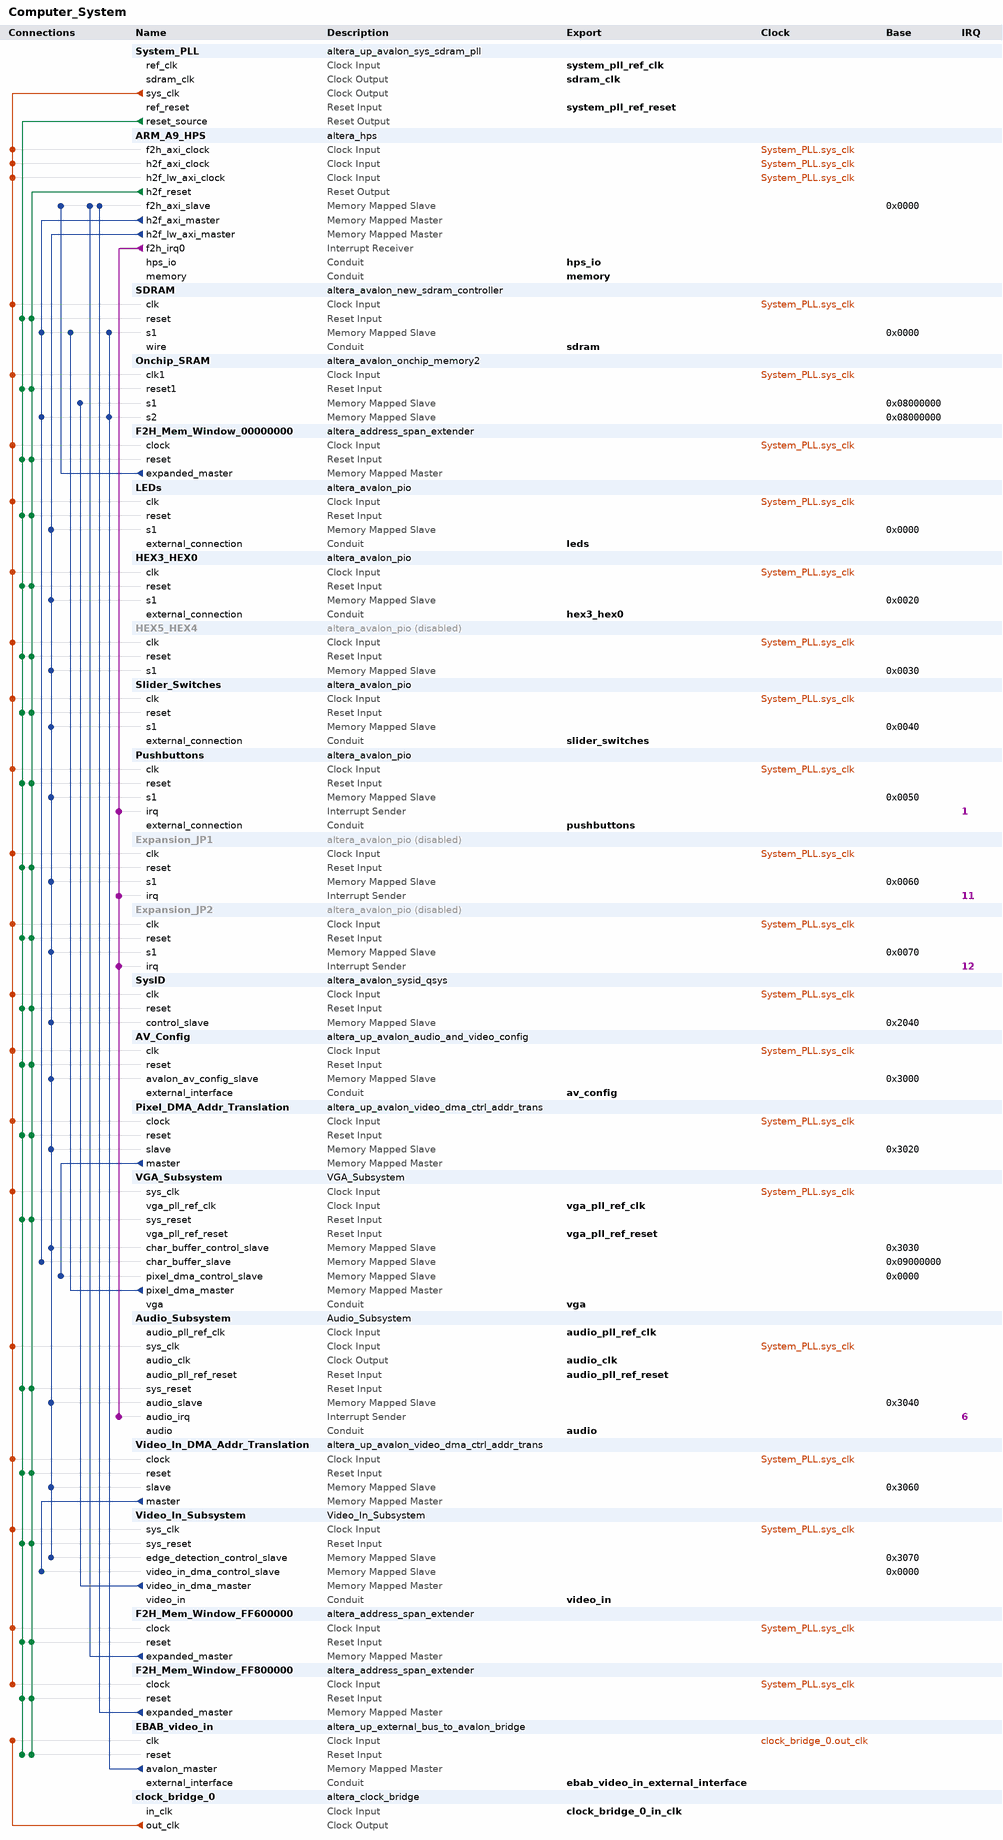
[diagram p0: system contents]
# Platform Designer (Qsys) system Computer_System, Cyclone V 5CSEMA5F31C6
# Parameters at their usual value, and those the tool derives, are not listed.
package require -exact qsys 15.0
create_system Computer_System
set_project_property DEVICE_FAMILY {Cyclone V}
set_project_property DEVICE 5CSEMA5F31C6

add_instance System_PLL altera_up_avalon_sys_sdram_pll 15.0
set_instance_parameter_value System_PLL CV_boards DE1-SoC
set_instance_parameter_value System_PLL gui_outclk 100.0
set_instance_parameter_value System_PLL gui_refclk 50.0

add_instance ARM_A9_HPS altera_hps 15.0
set_instance_parameter_value ARM_A9_HPS EMAC1_Mode RGMII
set_instance_parameter_value ARM_A9_HPS EMAC1_PinMuxing {HPS I/O Set 0}
set_instance_parameter_value ARM_A9_HPS F2SCLK_COLDRST_Enable false
set_instance_parameter_value ARM_A9_HPS F2SCLK_DBGRST_Enable false
set_instance_parameter_value ARM_A9_HPS F2SCLK_WARMRST_Enable false
set_instance_parameter_value ARM_A9_HPS F2SINTERRUPT_Enable true
set_instance_parameter_value ARM_A9_HPS F2S_Width 2
set_instance_parameter_value ARM_A9_HPS FPGA_PERIPHERAL_OUTPUT_CLOCK_FREQ_EMAC0_GTX_CLK 125
set_instance_parameter_value ARM_A9_HPS FPGA_PERIPHERAL_OUTPUT_CLOCK_FREQ_EMAC0_MD_CLK 100.0
set_instance_parameter_value ARM_A9_HPS FPGA_PERIPHERAL_OUTPUT_CLOCK_FREQ_EMAC1_GTX_CLK 125
set_instance_parameter_value ARM_A9_HPS FPGA_PERIPHERAL_OUTPUT_CLOCK_FREQ_EMAC1_MD_CLK 100.0
set_instance_parameter_value ARM_A9_HPS HPS_PROTOCOL DDR3
set_instance_parameter_value ARM_A9_HPS I2C0_Mode I2C
set_instance_parameter_value ARM_A9_HPS I2C0_PinMuxing {HPS I/O Set 0}
set_instance_parameter_value ARM_A9_HPS I2C1_Mode I2C
set_instance_parameter_value ARM_A9_HPS I2C1_PinMuxing {HPS I/O Set 0}
set_instance_parameter_value ARM_A9_HPS LWH2F_Enable true
set_instance_parameter_value ARM_A9_HPS MEM_BANKADDR_WIDTH 3
set_instance_parameter_value ARM_A9_HPS MEM_CLK_FREQ 400.0
set_instance_parameter_value ARM_A9_HPS MEM_COL_ADDR_WIDTH 10
set_instance_parameter_value ARM_A9_HPS MEM_DQ_WIDTH 32
set_instance_parameter_value ARM_A9_HPS MEM_DRV_STR RZQ/7
set_instance_parameter_value ARM_A9_HPS MEM_ROW_ADDR_WIDTH 15
set_instance_parameter_value ARM_A9_HPS MEM_RTT_NOM RZQ/4
set_instance_parameter_value ARM_A9_HPS MEM_RTT_WR RZQ/4
set_instance_parameter_value ARM_A9_HPS MEM_TCL 11
set_instance_parameter_value ARM_A9_HPS MEM_TFAW_NS 30.0
set_instance_parameter_value ARM_A9_HPS MEM_TRAS_NS 35.0
set_instance_parameter_value ARM_A9_HPS MEM_TRCD_NS 13.75
set_instance_parameter_value ARM_A9_HPS MEM_TRFC_NS 260.0
set_instance_parameter_value ARM_A9_HPS MEM_TRP_NS 13.75
set_instance_parameter_value ARM_A9_HPS MEM_VENDOR JEDEC
set_instance_parameter_value ARM_A9_HPS MEM_WTCL 8
set_instance_parameter_value ARM_A9_HPS QSPI_Mode {1 SS}
set_instance_parameter_value ARM_A9_HPS QSPI_PinMuxing {HPS I/O Set 0}
set_instance_parameter_value ARM_A9_HPS REF_CLK_FREQ 25.0
set_instance_parameter_value ARM_A9_HPS S2F_Width 3
set_instance_parameter_value ARM_A9_HPS SDIO_Mode {4-bit Data}
set_instance_parameter_value ARM_A9_HPS SDIO_PinMuxing {HPS I/O Set 0}
set_instance_parameter_value ARM_A9_HPS SPIM1_Mode {Single Slave Select}
set_instance_parameter_value ARM_A9_HPS SPIM1_PinMuxing {HPS I/O Set 0}
set_instance_parameter_value ARM_A9_HPS STM_Enable false
set_instance_parameter_value ARM_A9_HPS TIMING_BOARD_AC_SKEW 0.03
set_instance_parameter_value ARM_A9_HPS TIMING_BOARD_AC_TO_CK_SKEW 0.0
set_instance_parameter_value ARM_A9_HPS TIMING_BOARD_DQ_TO_DQS_SKEW 0.0
set_instance_parameter_value ARM_A9_HPS TIMING_BOARD_MAX_CK_DELAY 0.03
set_instance_parameter_value ARM_A9_HPS TIMING_BOARD_MAX_DQS_DELAY 0.02
set_instance_parameter_value ARM_A9_HPS TIMING_BOARD_SKEW_BETWEEN_DQS 0.08
set_instance_parameter_value ARM_A9_HPS TIMING_BOARD_SKEW_CKDQS_DIMM_MAX 0.16
set_instance_parameter_value ARM_A9_HPS TIMING_BOARD_SKEW_CKDQS_DIMM_MIN 0.09
set_instance_parameter_value ARM_A9_HPS TIMING_BOARD_SKEW_WITHIN_DQS 0.01
set_instance_parameter_value ARM_A9_HPS TIMING_TDH 65
set_instance_parameter_value ARM_A9_HPS TIMING_TDQSCK 255
set_instance_parameter_value ARM_A9_HPS TIMING_TDQSQ 125
set_instance_parameter_value ARM_A9_HPS TIMING_TDS 30
set_instance_parameter_value ARM_A9_HPS TIMING_TIH 140
set_instance_parameter_value ARM_A9_HPS TIMING_TIS 180
set_instance_parameter_value ARM_A9_HPS TIMING_TQSH 0.4
set_instance_parameter_value ARM_A9_HPS UART0_Mode {No Flow Control}
set_instance_parameter_value ARM_A9_HPS UART0_PinMuxing {HPS I/O Set 0}
set_instance_parameter_value ARM_A9_HPS USB1_Mode SDR
set_instance_parameter_value ARM_A9_HPS USB1_PinMuxing {HPS I/O Set 0}
set_instance_parameter_value ARM_A9_HPS desired_cfg_clk_mhz 100.0
set_instance_parameter_value ARM_A9_HPS desired_qspi_clk_mhz 400.0

add_instance SDRAM altera_avalon_new_sdram_controller 15.0
set_instance_parameter_value SDRAM TAC 5.5
set_instance_parameter_value SDRAM TRCD 20.0
set_instance_parameter_value SDRAM TRP 20.0
set_instance_parameter_value SDRAM casLatency 3
set_instance_parameter_value SDRAM columnWidth 10
set_instance_parameter_value SDRAM dataWidth 16
set_instance_parameter_value SDRAM generateSimulationModel true
set_instance_parameter_value SDRAM model single_Micron_MT48LC4M32B2_7_chip
set_instance_parameter_value SDRAM numberOfBanks 4
set_instance_parameter_value SDRAM numberOfChipSelects 1
set_instance_parameter_value SDRAM powerUpDelay 100.0
set_instance_parameter_value SDRAM refreshPeriod 15.625
set_instance_parameter_value SDRAM rowWidth 13

add_instance Onchip_SRAM altera_avalon_onchip_memory2 15.0
set_instance_parameter_value Onchip_SRAM dataWidth 8
set_instance_parameter_value Onchip_SRAM dualPort true
set_instance_parameter_value Onchip_SRAM initMemContent false
set_instance_parameter_value Onchip_SRAM initializationFileName onchip_mem.hex
set_instance_parameter_value Onchip_SRAM memorySize 131072
set_instance_parameter_value Onchip_SRAM singleClockOperation true

add_instance F2H_Mem_Window_00000000 altera_address_span_extender 15.0
set_instance_parameter_value F2H_Mem_Window_00000000 BURSTCOUNT_WIDTH 1
set_instance_parameter_value F2H_Mem_Window_00000000 DATA_WIDTH 32
set_instance_parameter_value F2H_Mem_Window_00000000 ENABLE_SLAVE_PORT false
set_instance_parameter_value F2H_Mem_Window_00000000 MASTER_ADDRESS_DEF 0
set_instance_parameter_value F2H_Mem_Window_00000000 MAX_PENDING_READS 1
set_instance_parameter_value F2H_Mem_Window_00000000 SLAVE_ADDRESS_WIDTH 28

add_instance LEDs altera_avalon_pio 15.0
set_instance_parameter_value LEDs direction Output
set_instance_parameter_value LEDs width 10

add_instance HEX3_HEX0 altera_avalon_pio 15.0
set_instance_parameter_value HEX3_HEX0 direction Output
set_instance_parameter_value HEX3_HEX0 width 16

add_instance HEX5_HEX4 altera_avalon_pio 15.0
set_instance_property HEX5_HEX4 ENABLED false
set_instance_parameter_value HEX5_HEX4 direction Output
set_instance_parameter_value HEX5_HEX4 width 16

add_instance Slider_Switches altera_avalon_pio 15.0
set_instance_parameter_value Slider_Switches direction Input
set_instance_parameter_value Slider_Switches simDoTestBenchWiring true
set_instance_parameter_value Slider_Switches width 10

add_instance Pushbuttons altera_avalon_pio 15.0
set_instance_parameter_value Pushbuttons bitClearingEdgeCapReg true
set_instance_parameter_value Pushbuttons captureEdge true
set_instance_parameter_value Pushbuttons direction Input
set_instance_parameter_value Pushbuttons edgeType FALLING
set_instance_parameter_value Pushbuttons generateIRQ true
set_instance_parameter_value Pushbuttons irqType EDGE
set_instance_parameter_value Pushbuttons simDoTestBenchWiring true
set_instance_parameter_value Pushbuttons width 4

add_instance Expansion_JP1 altera_avalon_pio 15.0
set_instance_property Expansion_JP1 ENABLED false
set_instance_parameter_value Expansion_JP1 bitClearingEdgeCapReg true
set_instance_parameter_value Expansion_JP1 captureEdge true
set_instance_parameter_value Expansion_JP1 direction Bidir
set_instance_parameter_value Expansion_JP1 edgeType FALLING
set_instance_parameter_value Expansion_JP1 generateIRQ true
set_instance_parameter_value Expansion_JP1 irqType EDGE
set_instance_parameter_value Expansion_JP1 simDoTestBenchWiring true
set_instance_parameter_value Expansion_JP1 width 32

add_instance Expansion_JP2 altera_avalon_pio 15.0
set_instance_property Expansion_JP2 ENABLED false
set_instance_parameter_value Expansion_JP2 bitClearingEdgeCapReg true
set_instance_parameter_value Expansion_JP2 captureEdge true
set_instance_parameter_value Expansion_JP2 direction Bidir
set_instance_parameter_value Expansion_JP2 edgeType FALLING
set_instance_parameter_value Expansion_JP2 generateIRQ true
set_instance_parameter_value Expansion_JP2 irqType EDGE
set_instance_parameter_value Expansion_JP2 simDoTestBenchWiring true
set_instance_parameter_value Expansion_JP2 width 32

add_instance SysID altera_avalon_sysid_qsys 15.0
set_instance_parameter_value SysID id 0

add_instance AV_Config altera_up_avalon_audio_and_video_config 15.0
set_instance_parameter_value AV_Config audio_in {Microphone to ADC}
set_instance_parameter_value AV_Config bit_length 32
set_instance_parameter_value AV_Config board DE1-SoC
set_instance_parameter_value AV_Config line_in_bypass false
set_instance_parameter_value AV_Config sampling_rate {48 kHz}

add_instance Pixel_DMA_Addr_Translation altera_up_avalon_video_dma_ctrl_addr_trans 15.0

add_instance VGA_Subsystem VGA_Subsystem 1.0

add_instance Audio_Subsystem Audio_Subsystem 1.0

add_instance Video_In_DMA_Addr_Translation altera_up_avalon_video_dma_ctrl_addr_trans 15.0

add_instance Video_In_Subsystem Video_In_Subsystem 1.0

add_instance F2H_Mem_Window_FF600000 altera_address_span_extender 15.0
set_instance_parameter_value F2H_Mem_Window_FF600000 BURSTCOUNT_WIDTH 1
set_instance_parameter_value F2H_Mem_Window_FF600000 DATA_WIDTH 32
set_instance_parameter_value F2H_Mem_Window_FF600000 ENABLE_SLAVE_PORT false
set_instance_parameter_value F2H_Mem_Window_FF600000 MASTER_ADDRESS_DEF 4284481536
set_instance_parameter_value F2H_Mem_Window_FF600000 MAX_PENDING_READS 1
set_instance_parameter_value F2H_Mem_Window_FF600000 SLAVE_ADDRESS_WIDTH 19

add_instance F2H_Mem_Window_FF800000 altera_address_span_extender 15.0
set_instance_parameter_value F2H_Mem_Window_FF800000 BURSTCOUNT_WIDTH 1
set_instance_parameter_value F2H_Mem_Window_FF800000 DATA_WIDTH 32
set_instance_parameter_value F2H_Mem_Window_FF800000 ENABLE_SLAVE_PORT false
set_instance_parameter_value F2H_Mem_Window_FF800000 MASTER_ADDRESS_DEF 4286578688
set_instance_parameter_value F2H_Mem_Window_FF800000 MAX_PENDING_READS 1
set_instance_parameter_value F2H_Mem_Window_FF800000 SLAVE_ADDRESS_WIDTH 21

add_instance EBAB_video_in altera_up_external_bus_to_avalon_bridge 15.0
set_instance_parameter_value EBAB_video_in addr_size 512
set_instance_parameter_value EBAB_video_in addr_size_multiplier Mbytes
set_instance_parameter_value EBAB_video_in data_size 8

add_instance clock_bridge_0 altera_clock_bridge 15.0
set_instance_parameter_value clock_bridge_0 DERIVED_CLOCK_RATE 0
set_instance_parameter_value clock_bridge_0 EXPLICIT_CLOCK_RATE 50000000

# connections
add_connection clock_bridge_0.out_clk EBAB_video_in.clk clock
add_connection System_PLL.sys_clk ARM_A9_HPS.f2h_axi_clock clock
add_connection System_PLL.sys_clk ARM_A9_HPS.h2f_axi_clock clock
add_connection System_PLL.sys_clk ARM_A9_HPS.h2f_lw_axi_clock clock
add_connection System_PLL.sys_clk Audio_Subsystem.sys_clk clock
add_connection System_PLL.sys_clk AV_Config.clk clock
add_connection System_PLL.sys_clk Expansion_JP1.clk clock
add_connection System_PLL.sys_clk Expansion_JP2.clk clock
add_connection System_PLL.sys_clk F2H_Mem_Window_00000000.clock clock
add_connection System_PLL.sys_clk F2H_Mem_Window_FF600000.clock clock
add_connection System_PLL.sys_clk F2H_Mem_Window_FF800000.clock clock
add_connection System_PLL.sys_clk HEX3_HEX0.clk clock
add_connection System_PLL.sys_clk HEX5_HEX4.clk clock
add_connection System_PLL.sys_clk LEDs.clk clock
add_connection System_PLL.sys_clk Onchip_SRAM.clk1 clock
add_connection System_PLL.sys_clk Pixel_DMA_Addr_Translation.clock clock
add_connection System_PLL.sys_clk Pushbuttons.clk clock
add_connection System_PLL.sys_clk SDRAM.clk clock
add_connection System_PLL.sys_clk Slider_Switches.clk clock
add_connection System_PLL.sys_clk SysID.clk clock
add_connection System_PLL.sys_clk VGA_Subsystem.sys_clk clock
add_connection System_PLL.sys_clk Video_In_DMA_Addr_Translation.clock clock
add_connection System_PLL.sys_clk Video_In_Subsystem.sys_clk clock
add_connection ARM_A9_HPS.h2f_reset Audio_Subsystem.sys_reset reset
add_connection ARM_A9_HPS.h2f_reset AV_Config.reset reset
add_connection ARM_A9_HPS.h2f_reset EBAB_video_in.reset reset
add_connection ARM_A9_HPS.h2f_reset Expansion_JP1.reset reset
add_connection ARM_A9_HPS.h2f_reset Expansion_JP2.reset reset
add_connection ARM_A9_HPS.h2f_reset F2H_Mem_Window_00000000.reset reset
add_connection ARM_A9_HPS.h2f_reset F2H_Mem_Window_FF600000.reset reset
add_connection ARM_A9_HPS.h2f_reset F2H_Mem_Window_FF800000.reset reset
add_connection ARM_A9_HPS.h2f_reset HEX3_HEX0.reset reset
add_connection ARM_A9_HPS.h2f_reset HEX5_HEX4.reset reset
add_connection ARM_A9_HPS.h2f_reset LEDs.reset reset
add_connection ARM_A9_HPS.h2f_reset Onchip_SRAM.reset1 reset
add_connection ARM_A9_HPS.h2f_reset Pixel_DMA_Addr_Translation.reset reset
add_connection ARM_A9_HPS.h2f_reset Pushbuttons.reset reset
add_connection ARM_A9_HPS.h2f_reset SDRAM.reset reset
add_connection ARM_A9_HPS.h2f_reset Slider_Switches.reset reset
add_connection ARM_A9_HPS.h2f_reset SysID.reset reset
add_connection ARM_A9_HPS.h2f_reset VGA_Subsystem.sys_reset reset
add_connection ARM_A9_HPS.h2f_reset Video_In_DMA_Addr_Translation.reset reset
add_connection ARM_A9_HPS.h2f_reset Video_In_Subsystem.sys_reset reset
add_connection System_PLL.reset_source Audio_Subsystem.sys_reset reset
add_connection System_PLL.reset_source AV_Config.reset reset
add_connection System_PLL.reset_source EBAB_video_in.reset reset
add_connection System_PLL.reset_source Expansion_JP1.reset reset
add_connection System_PLL.reset_source Expansion_JP2.reset reset
add_connection System_PLL.reset_source F2H_Mem_Window_00000000.reset reset
add_connection System_PLL.reset_source F2H_Mem_Window_FF600000.reset reset
add_connection System_PLL.reset_source F2H_Mem_Window_FF800000.reset reset
add_connection System_PLL.reset_source HEX3_HEX0.reset reset
add_connection System_PLL.reset_source HEX5_HEX4.reset reset
add_connection System_PLL.reset_source LEDs.reset reset
add_connection System_PLL.reset_source Onchip_SRAM.reset1 reset
add_connection System_PLL.reset_source Pixel_DMA_Addr_Translation.reset reset
add_connection System_PLL.reset_source Pushbuttons.reset reset
add_connection System_PLL.reset_source SDRAM.reset reset
add_connection System_PLL.reset_source Slider_Switches.reset reset
add_connection System_PLL.reset_source SysID.reset reset
add_connection System_PLL.reset_source VGA_Subsystem.sys_reset reset
add_connection System_PLL.reset_source Video_In_DMA_Addr_Translation.reset reset
add_connection System_PLL.reset_source Video_In_Subsystem.sys_reset reset
add_connection ARM_A9_HPS.h2f_axi_master Onchip_SRAM.s2 avalon
set_connection_parameter_value ARM_A9_HPS.h2f_axi_master/Onchip_SRAM.s2 baseAddress 0x08000000
add_connection ARM_A9_HPS.h2f_axi_master SDRAM.s1 avalon
set_connection_parameter_value ARM_A9_HPS.h2f_axi_master/SDRAM.s1 baseAddress 0x0000
add_connection ARM_A9_HPS.h2f_axi_master VGA_Subsystem.char_buffer_slave avalon
set_connection_parameter_value ARM_A9_HPS.h2f_axi_master/VGA_Subsystem.char_buffer_slave baseAddress 0x09000000
add_connection ARM_A9_HPS.h2f_lw_axi_master Audio_Subsystem.audio_slave avalon
set_connection_parameter_value ARM_A9_HPS.h2f_lw_axi_master/Audio_Subsystem.audio_slave baseAddress 0x3040
add_connection ARM_A9_HPS.h2f_lw_axi_master AV_Config.avalon_av_config_slave avalon
set_connection_parameter_value ARM_A9_HPS.h2f_lw_axi_master/AV_Config.avalon_av_config_slave baseAddress 0x3000
add_connection ARM_A9_HPS.h2f_lw_axi_master Expansion_JP1.s1 avalon
set_connection_parameter_value ARM_A9_HPS.h2f_lw_axi_master/Expansion_JP1.s1 baseAddress 0x0060
add_connection ARM_A9_HPS.h2f_lw_axi_master Expansion_JP2.s1 avalon
set_connection_parameter_value ARM_A9_HPS.h2f_lw_axi_master/Expansion_JP2.s1 baseAddress 0x0070
add_connection ARM_A9_HPS.h2f_lw_axi_master HEX3_HEX0.s1 avalon
set_connection_parameter_value ARM_A9_HPS.h2f_lw_axi_master/HEX3_HEX0.s1 baseAddress 0x0020
add_connection ARM_A9_HPS.h2f_lw_axi_master HEX5_HEX4.s1 avalon
set_connection_parameter_value ARM_A9_HPS.h2f_lw_axi_master/HEX5_HEX4.s1 baseAddress 0x0030
add_connection ARM_A9_HPS.h2f_lw_axi_master LEDs.s1 avalon
set_connection_parameter_value ARM_A9_HPS.h2f_lw_axi_master/LEDs.s1 baseAddress 0x0000
add_connection ARM_A9_HPS.h2f_lw_axi_master Pixel_DMA_Addr_Translation.slave avalon
set_connection_parameter_value ARM_A9_HPS.h2f_lw_axi_master/Pixel_DMA_Addr_Translation.slave baseAddress 0x3020
add_connection ARM_A9_HPS.h2f_lw_axi_master Pushbuttons.s1 avalon
set_connection_parameter_value ARM_A9_HPS.h2f_lw_axi_master/Pushbuttons.s1 baseAddress 0x0050
add_connection ARM_A9_HPS.h2f_lw_axi_master Slider_Switches.s1 avalon
set_connection_parameter_value ARM_A9_HPS.h2f_lw_axi_master/Slider_Switches.s1 baseAddress 0x0040
add_connection ARM_A9_HPS.h2f_lw_axi_master SysID.control_slave avalon
set_connection_parameter_value ARM_A9_HPS.h2f_lw_axi_master/SysID.control_slave baseAddress 0x2040
add_connection ARM_A9_HPS.h2f_lw_axi_master VGA_Subsystem.char_buffer_control_slave avalon
set_connection_parameter_value ARM_A9_HPS.h2f_lw_axi_master/VGA_Subsystem.char_buffer_control_slave baseAddress 0x3030
add_connection ARM_A9_HPS.h2f_lw_axi_master Video_In_DMA_Addr_Translation.slave avalon
set_connection_parameter_value ARM_A9_HPS.h2f_lw_axi_master/Video_In_DMA_Addr_Translation.slave baseAddress 0x3060
add_connection ARM_A9_HPS.h2f_lw_axi_master Video_In_Subsystem.edge_detection_control_slave avalon
set_connection_parameter_value ARM_A9_HPS.h2f_lw_axi_master/Video_In_Subsystem.edge_detection_control_slave baseAddress 0x3070
add_connection EBAB_video_in.avalon_master Onchip_SRAM.s2 avalon
set_connection_parameter_value EBAB_video_in.avalon_master/Onchip_SRAM.s2 baseAddress 0x08000000
add_connection EBAB_video_in.avalon_master SDRAM.s1 avalon
set_connection_parameter_value EBAB_video_in.avalon_master/SDRAM.s1 baseAddress 0x0000
add_connection F2H_Mem_Window_00000000.expanded_master ARM_A9_HPS.f2h_axi_slave avalon
set_connection_parameter_value F2H_Mem_Window_00000000.expanded_master/ARM_A9_HPS.f2h_axi_slave baseAddress 0x0000
add_connection F2H_Mem_Window_FF600000.expanded_master ARM_A9_HPS.f2h_axi_slave avalon
set_connection_parameter_value F2H_Mem_Window_FF600000.expanded_master/ARM_A9_HPS.f2h_axi_slave baseAddress 0x0000
add_connection F2H_Mem_Window_FF800000.expanded_master ARM_A9_HPS.f2h_axi_slave avalon
set_connection_parameter_value F2H_Mem_Window_FF800000.expanded_master/ARM_A9_HPS.f2h_axi_slave baseAddress 0x0000
add_connection Pixel_DMA_Addr_Translation.master VGA_Subsystem.pixel_dma_control_slave avalon
set_connection_parameter_value Pixel_DMA_Addr_Translation.master/VGA_Subsystem.pixel_dma_control_slave baseAddress 0x0000
add_connection VGA_Subsystem.pixel_dma_master SDRAM.s1 avalon
set_connection_parameter_value VGA_Subsystem.pixel_dma_master/SDRAM.s1 baseAddress 0x0000
add_connection Video_In_DMA_Addr_Translation.master Video_In_Subsystem.video_in_dma_control_slave avalon
set_connection_parameter_value Video_In_DMA_Addr_Translation.master/Video_In_Subsystem.video_in_dma_control_slave baseAddress 0x0000
add_connection Video_In_Subsystem.video_in_dma_master Onchip_SRAM.s1 avalon
set_connection_parameter_value Video_In_Subsystem.video_in_dma_master/Onchip_SRAM.s1 baseAddress 0x08000000
add_connection ARM_A9_HPS.f2h_irq0 Audio_Subsystem.audio_irq interrupt
set_connection_parameter_value ARM_A9_HPS.f2h_irq0/Audio_Subsystem.audio_irq irqNumber 6
add_connection ARM_A9_HPS.f2h_irq0 Expansion_JP1.irq interrupt
set_connection_parameter_value ARM_A9_HPS.f2h_irq0/Expansion_JP1.irq irqNumber 11
add_connection ARM_A9_HPS.f2h_irq0 Expansion_JP2.irq interrupt
set_connection_parameter_value ARM_A9_HPS.f2h_irq0/Expansion_JP2.irq irqNumber 12
add_connection ARM_A9_HPS.f2h_irq0 Pushbuttons.irq interrupt
set_connection_parameter_value ARM_A9_HPS.f2h_irq0/Pushbuttons.irq irqNumber 1

# exported interfaces
add_interface audio conduit end
set_interface_property audio EXPORT_OF Audio_Subsystem.audio
add_interface audio_clk clock source
set_interface_property audio_clk EXPORT_OF Audio_Subsystem.audio_clk
add_interface audio_pll_ref_clk clock sink
set_interface_property audio_pll_ref_clk EXPORT_OF Audio_Subsystem.audio_pll_ref_clk
add_interface audio_pll_ref_reset reset sink
set_interface_property audio_pll_ref_reset EXPORT_OF Audio_Subsystem.audio_pll_ref_reset
add_interface av_config conduit end
set_interface_property av_config EXPORT_OF AV_Config.external_interface
add_interface clock_bridge_0_in_clk clock sink
set_interface_property clock_bridge_0_in_clk EXPORT_OF clock_bridge_0.in_clk
add_interface ebab_video_in_external_interface conduit end
set_interface_property ebab_video_in_external_interface EXPORT_OF EBAB_video_in.external_interface
add_interface hex3_hex0 conduit end
set_interface_property hex3_hex0 EXPORT_OF HEX3_HEX0.external_connection
add_interface hps_io conduit end
set_interface_property hps_io EXPORT_OF ARM_A9_HPS.hps_io
add_interface leds conduit end
set_interface_property leds EXPORT_OF LEDs.external_connection
add_interface memory conduit end
set_interface_property memory EXPORT_OF ARM_A9_HPS.memory
add_interface pushbuttons conduit end
set_interface_property pushbuttons EXPORT_OF Pushbuttons.external_connection
add_interface sdram conduit end
set_interface_property sdram EXPORT_OF SDRAM.wire
add_interface sdram_clk clock source
set_interface_property sdram_clk EXPORT_OF System_PLL.sdram_clk
add_interface slider_switches conduit end
set_interface_property slider_switches EXPORT_OF Slider_Switches.external_connection
add_interface system_pll_ref_clk clock sink
set_interface_property system_pll_ref_clk EXPORT_OF System_PLL.ref_clk
add_interface system_pll_ref_reset reset sink
set_interface_property system_pll_ref_reset EXPORT_OF System_PLL.ref_reset
add_interface vga conduit end
set_interface_property vga EXPORT_OF VGA_Subsystem.vga
add_interface vga_pll_ref_clk clock sink
set_interface_property vga_pll_ref_clk EXPORT_OF VGA_Subsystem.vga_pll_ref_clk
add_interface vga_pll_ref_reset reset sink
set_interface_property vga_pll_ref_reset EXPORT_OF VGA_Subsystem.vga_pll_ref_reset
add_interface video_in conduit end
set_interface_property video_in EXPORT_OF Video_In_Subsystem.video_in

set_interconnect_requirement {$system} qsys_mm.clockCrossingAdapter HANDSHAKE
set_interconnect_requirement {$system} qsys_mm.enableEccProtection FALSE
set_interconnect_requirement {$system} qsys_mm.insertDefaultSlave FALSE
set_interconnect_requirement {$system} qsys_mm.maxAdditionalLatency 1

save_system Computer_System.qsys
